# Altium schematic sheet Sensor_Glove_Sensors-X01.SchDoc: DB_Sensors-X02
size Letter; Organization: Georiga Tech; Address1: North Ave NW; Address3: Atlanta, GA; Address4: USA 30332; DocumentNumber: 1; Revision: X02; SheetNumber: 5; SheetTotal: 5
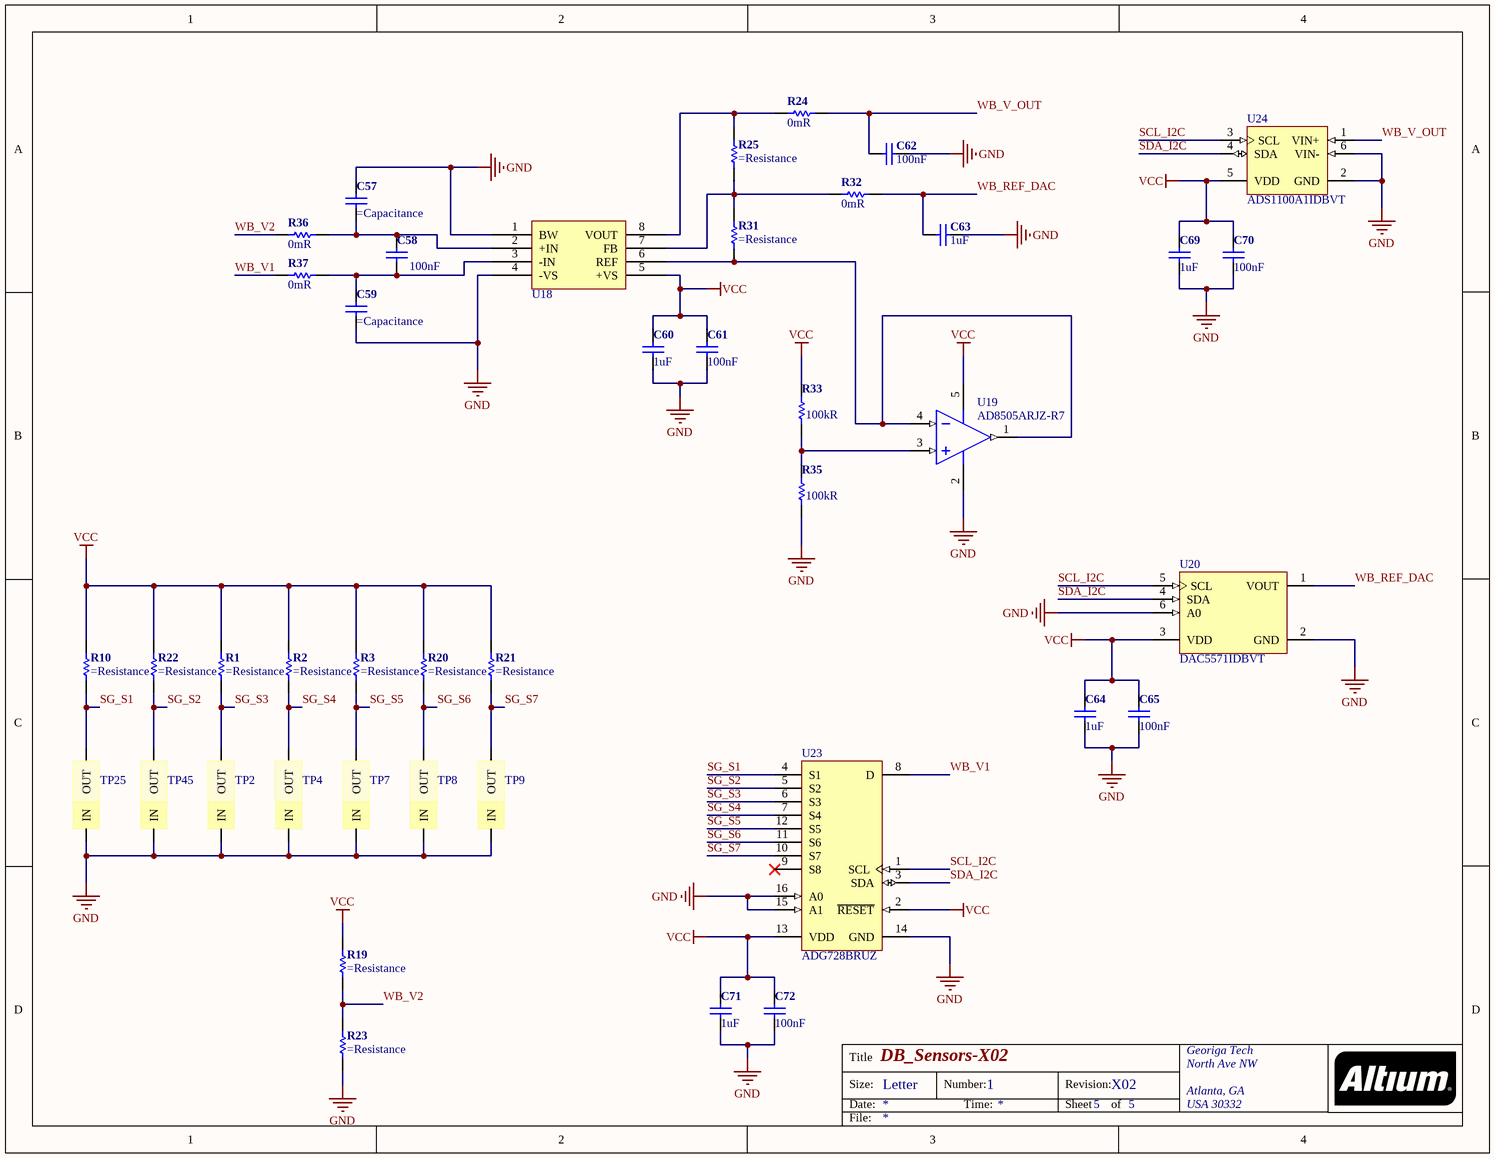
[diagram p0: Sensor_Glove_Sensors-X01.SchDoc]

## Parts
C57  (no value)  [C0402]
C58  100nF  [C0402]
C59  (no value)  [C0402]
C60  1uF  [C0402]
C61  100nF  [C0402]
C62  100nF  [C0402]
C63  1uF  [C0402]
C64  1uF  [C0402]
C65  100nF  [C0402]
C69  1uF  [C0402]
C70  100nF  [C0402]
C71  1uF  [C0402]
C72  100nF  [C0402]
R1  (no value)  [R0402]
R2  (no value)  [R0402]
R3  (no value)  [R0402]
R10  (no value)  [R0402]
R19  (no value)  [R0402]
R20  (no value)  [R0402]
R21  (no value)  [R0402]
R22  (no value)  [R0402]
R23  (no value)  [R0402]
R24  0mR  [R0402]
R25  (no value)  [R0402]
R31  (no value)  [R0402]
R32  0mR  [R0402]
R33  100kR  [R0402]
R35  100kR  [R0402]
R36  0mR  [R0402]
R37  0mR  [R0402]
TP2  JUMPER  [JUMPER]  (value not drawn)
TP4  JUMPER  [JUMPER]  (value not drawn)
TP7  JUMPER  [JUMPER]  (value not drawn)
TP8  JUMPER  [JUMPER]  (value not drawn)
TP9  JUMPER  [JUMPER]  (value not drawn)
TP25  JUMPER  [JUMPER]  (value not drawn)
TP45  JUMPER  [JUMPER]  (value not drawn)
U18  Instrumentation Amplifier  [8-MSOP]  (value not drawn)
U19  AD8505ARJZ-R7  [ADI-RJ-5_N]
U20  DAC5571IDBVT  [TI-DBV6_M]
U23  ADG728BRUZ  [ADI-RU-16_M]
U24  ADS1100A1IDBVT  [TI-DBV6_N]

## Nets
GND: C57.1 C59.2 C60.2 C61.2 C62.2 C63.2 C64.2 C65.2 C69.2 C70.2 C71.2 C72.2 R23.2 R35.2 TP2.1(IN) TP4.1(IN) TP7.1(IN) TP8.1(IN) TP9.1(IN) TP25.1(IN) TP45.1(IN) U18.1(BW) U18.4(-VS) U19.2(-V) U20.2(GND) U20.6(A0) U23.14(GND) U23.15(A1) U23.16(A0) U24.2(GND) U24.6(VIN-)
VCC: C60.1 C61.1 C64.1 C65.1 C69.1 C70.1 C71.1 C72.1 R1.1 R2.1 R3.1 R10.1 R19.1 R20.1 R21.1 R22.1 R33.1 U18.5(+VS) U19.5(+V) U20.3(VDD) U23.2(~{RESET}) U23.13(VDD) U24.5(VDD)
SCL_I2C: U20.5(SCL) U23.1(SCL) U24.3(SCL)
SDA_I2C: U20.4(SDA) U23.3(SDA) U24.4(SDA)
SG_S1: R10.2 TP25.2(OUT) U23.4(S1)
SG_S2: R22.2 TP45.2(OUT) U23.5(S2)
SG_S3: R1.2 TP2.2(OUT) U23.6(S3)
SG_S4: R2.2 TP4.2(OUT) U23.7(S4)
SG_S5: R3.2 TP7.2(OUT) U23.12(S5)
SG_S6: R20.2 TP8.2(OUT) U23.11(S6)
SG_S7: R21.2 TP9.2(OUT) U23.10(S7)
WB_REF_DAC: C63.1 R32.2 U20.1(VOUT)
WB_V1: R37.1 U23.8(D)
WB_V2: R19.2 R23.1 R36.1
WB_V_OUT: C62.1 R24.2 U24.1(VIN+)
NetC57_2: C57.2 C58.1 R36.2 U18.2(+IN)
NetC58_2: C58.2 C59.1 R37.2 U18.3(-IN)
NetR24_1: R24.1 R25.2 U18.8(VOUT)
NetR25_1: R25.1 R31.2 R32.1 U18.7(FB)
NetR31_1: R31.1 U18.6(REF) U19.1(OUT) U19.4(-IN)
NetR33_2: R33.2 R35.1 U19.3(+IN)

Not connected (* = marked no-connect by the designer): U23 9(S8)*

## Notes on the sheet
- Title
- Size:
- Date:
- Letter
- Number:
- Time:
- Revision:
- Sheet
- of
- File:

## Library data of the parts
C57 C59 = C-0402(1005): ___ OHM ___ mW 0402(1005) SMD; ComponentLink1URL: https://datasheet.ciiva.com/169/product-169683.pdf; ComponentLink1Description: https://datasheet.ciiva.com/169/product-169683.pdf
C58 C61 C62 C65 C70 C72 = C-0402(1005): Ceramic Capacitor, Multilayer, Ceramic, 25V, 10% +Tol, 10% -Tol, X5R, 15% TC, 0.1uF, Surface Mount, 0402; Manufacturer: Taiyo Yuden; Manufacturer Part Number: TMK105BJ104KV-F; ComponentLink1URL: https://datasheet.ciiva.com/169/product-169683.pdf; ComponentLink1Description: https://datasheet.ciiva.com/169/product-169683.pdf; Supplier 1: Digi-Key; Supplier Part Number 1: 587-1456-1-ND; RoHS: Yes; Category: Ceramic Capacitors; Stock 1: 21960903; Pricing 1: 1=0.10000, 10=0.04400, 50=0.02400, 100=0.01960, 500=0.01398, 1000=0.01098, 2500=0.00998, 5000=0.00918 (USD); Mount: Surface Mount; Case/Package: 0402; Number of Pins: 2; Weight: 2.3E-05oz; Case Code (Imperial): 0402; Case Code (Metric): 1005; Min Operating Temperature: -55°C; Max Operating Temperature: 85°C; Capacitance: 100nF; Tolerance: 10%; Packaging: Tape and Reel; Dielectric: X5R; Voltage Rating (DC): 25V; Voltage Rating: 25V; Package Quantity: 1; Termination: SMD/SMT; Resistor Type: Ceramic; Voltage: 25V; Length: 1mm; Height: 0.5mm; Width: 0.5mm; Depth: 0.5mm; Thickness: 0.022inch; REACH SVHC: No SVHC; Lead Free: Lead Free; Halogen Free: Halogen Free; ComponentLink2URL: https://datasheet.ciiva.com:443/pdfs/VipMasterIC/IC/TAIY/TAIY-S-A0009103435/TAIY-S-A0009103038-1.pdf?src-supplier=IHS+Markit; ComponentLink2Description: https://datasheet.ciiva.com:443/pdfs/VipMasterIC/IC/TAIY/TAIY-S-A0009103435/TAIY-S-A0009103038-1.pdf?src-supplier=IHS+Markit; ComponentLink3URL: https://datasheet.ciiva.com/30051/25tmk105bj104kv-f-30051094.pdf?src-supplier=Onlinecomponents.com; ComponentLink3Description: https://datasheet.ciiva.com/30051/25tmk105bj104kv-f-30051094.pdf?src-supplier=Onlinecomponents.com; ComponentLink4URL: https://datasheet.ciiva.com/15922/28tmk105bj104kv-f-15922315.pdf?src-supplier=Onlinecomponents.com; ComponentLink4Description: https://datasheet.ciiva.com/15922/28tmk105bj104kv-f-15922315.pdf?src-supplier=Onlinecomponents.com; ComponentLink5URL: https://datasheet.ciiva.com/131/tmk105bj104kv-f-ss-131420.pdf?src-supplier=Digi-Key; ComponentLink5Description: https://datasheet.ciiva.com/131/tmk105bj104kv-f-ss-131420.pdf?src-supplier=Digi-Key; ComponentLink6URL: https://datasheet.ciiva.com/22768/1693457-22768649.pdf?src-supplier=Farnell; ComponentLink6Description: https://datasheet.ciiva.com/22768/1693457-22768649.pdf?src-supplier=Farnell
C60 C63 C64 C69 C71 = C-0402(1005): Ceramic Capacitor, Multilayer, Ceramic, 6.3V, 20% +Tol, 20% -Tol, X5R, 15% TC, 1uF, Surface Mount, 0402; Manufacturer: Yageo; Manufacturer Part Number: CC0402MRX5R5BB105; Dissipation Factor: 10%; ComponentLink1URL: https://datasheet.ciiva.com/169/product-169683.pdf; ComponentLink1Description: https://datasheet.ciiva.com/169/product-169683.pdf; Supplier 1: Digi-Key; Supplier Part Number 1: 311-1441-1-ND; RoHS: Yes; Category: Ceramic Capacitors; Stock 1: 4097; Pricing 1: 1=0.12000, 10=0.08500, 50=0.04860, 100=0.04020, 500=0.02818, 1000=0.02333, 2500=0.02172, 5000=0.01987 (USD); Mount: Surface Mount; Case/Package: 0402; Number of Pins: 2; Case Code (Imperial): 0402; Case Code (Metric): 1005; Min Operating Temperature: -55°C; Max Operating Temperature: 85°C; Capacitance: 1uF; Tolerance: 20%; Voltage Rating: 6.3V; Voltage Rating (DC): 6.3V; Packaging: Tape and Reel; Package Quantity: 1; Dielectric: X5R; Termination: SMD/SMT; Resistor Type: Ceramic; Length: 1mm; Height: 0.5mm; Width: 0.5mm; Thickness: 0.022inch; Depth: 0.5mm; Lead Free: Lead Free; Halogen Free: Halogen Free; ComponentLink2URL: https://datasheet.ciiva.com:443/pdfs/VipMasterIC/IC/YAGO/YAGO-S-A0006851646/YAGO-S-A0006851646-1.pdf?src-supplier=IHS+Markit; ComponentLink2Description: https://datasheet.ciiva.com:443/pdfs/VipMasterIC/IC/YAGO/YAGO-S-A0006851646/YAGO-S-A0006851646-1.pdf?src-supplier=IHS+Markit; ComponentLink3URL: https://datasheet.ciiva.com/176/mlccorderingcode-176806.pdf?src-supplier=Digi-Key; ComponentLink3Description: https://datasheet.ciiva.com/176/mlccorderingcode-176806.pdf?src-supplier=Digi-Key; ComponentLink4URL: https://datasheet.ciiva.com/176/mlccorderingcode-176807.pdf?src-supplier=Digi-Key; ComponentLink4Description: https://datasheet.ciiva.com/176/mlccorderingcode-176807.pdf?src-supplier=Digi-Key; ComponentLink5URL: https://datasheet.ciiva.com/176/mlccorderingcode-176808.pdf?src-supplier=Digi-Key; ComponentLink5Description: https://datasheet.ciiva.com/176/mlccorderingcode-176808.pdf?src-supplier=Digi-Key
R1-R3 R10 R19-R23 R25 R31 = R-0402(1005): ___ OHM ___ mW 0402(1005) SMD
R24 R32 R36 R37 = R-0402(1005): Fixed Resistor, Metal Glaze/thick Film, 0.0625W, 0ohm, Surface Mount, 0402; Manufacturer: Yageo; Manufacturer Part Number: AC0402JR-070RL; Voltage Rating: 50V; Power Rating: 62.5mW; Tolerance: 5%; Temperature Coefficient: 200ppm/°C; Max Power Dissipation: 63mW; Supplier 1: Digi-Key; Supplier Part Number 1: 311-0.0LBCT-ND; RoHS: Yes; Category: Chip SMD Resistors; Stock 1: 1100119; Pricing 1: 1=0.10000, 10=0.01900, 25=0.01400, 50=0.01080, 100=0.00790, 250=0.00604, 500=0.00482, 1000=0.00355, 5000=0.00255 (USD); Case/Package: 0402; Case Code (Imperial): 0402; Case Code (Metric): 1005; Min Operating Temperature: -55°C; Max Operating Temperature: 155°C; Resistance: 0mR; Packaging: Tape and Reel; Package Quantity: 1; Resistor Type: Thick Film; Termination: SMD/SMT; Number of Terminations: 2; Features: Moisture Resistant,Automotive AEC-Q200,Anti-Sulfur; Length: 0.039inch; Height: 0.015inch; Width: 0.02inch; Lead Free: Lead Free; ComponentLink1URL: https://datasheet.ciiva.com:443/pdfs/VipMasterIC/IC/YAGO/YAGO-S-A0003597364/YAGO-S-A0003597364-1.pdf?src-supplier=IHS+Markit; ComponentLink1Description: https://datasheet.ciiva.com:443/pdfs/VipMasterIC/IC/YAGO/YAGO-S-A0003597364/YAGO-S-A0003597364-1.pdf?src-supplier=IHS+Markit; ComponentLink2URL: http://www.mouser.com/ds/2/447/yageodocoutput-1111992.pdf?src-supplier=Mouser; ComponentLink2Description: http://www.mouser.com/ds/2/447/yageodocoutput-1111992.pdf?src-supplier=Mouser; ComponentLink3URL: http://www.yageo.com/NewPortal/yageodocoutput?fileName=/pdf/R-Chip/PYu-AC_51_RoHS_L_6.pdf&src-supplier=Digi-Key; ComponentLink3Description: http://www.yageo.com/NewPortal/yageodocoutput?fileName=/pdf/R-Chip/PYu-AC_51_RoHS_L_6.pdf&src-supplier=Digi-Key; ComponentLink4URL: http://www.yageo.com/documents/recent/PYu-AC_51_RoHS_L_2_revised.pdf?src-supplier=Future+Electronics; ComponentLink4Description: http://www.yageo.com/documents/recent/PYu-AC_51_RoHS_L_2_revised.pdf?src-supplier=Future+Electronics
R33 R35 = R-0402(1005): Fixed Resistor, Metal Glaze/thick Film, 0.0625W, 100000ohm, 50V, 1% +/-Tol, 100ppm/Cel, Surface Mount, 0402; Manufacturer: Yageo; Manufacturer Part Number: AC0402FR-07100KL; Power Rating: 62.5mW; Max Power Dissipation: 63mW; Temperature Coefficient: 100ppm/°C; Supplier 1: Digi-Key; Supplier Part Number 1: YAG3434CT-ND; RoHS: Yes; Category: Chip SMD Resistors; Stock 1: 239006; Pricing 1: 1=0.10000, 10=0.02000, 100=0.00830, 1000=0.00374, 2500=0.00324, 5000=0.00268 (USD); Case/Package: 0402; Case Code (Imperial): 0402; Case Code (Metric): 1005; Min Operating Temperature: -55°C; Max Operating Temperature: 155°C; Resistance: 100kR; Tolerance: 1%; Packaging: Tape and Reel; Voltage Rating: 50V; Resistor Type: Thick Film; Number of Terminations: 2; Termination: SMD/SMT; Features: Moisture Resistant,Automotive AEC-Q200; Length: 1mm; Height: 0.015inch; Width: 0.02inch; Depth: 0.5mm; Military Standard: Not; Lead Free: Lead Free; ComponentLink1URL: https://datasheet.ciiva.com:443/pdfs/VipMasterIC/IC/YAGO/YAGO-S-A0003597364/YAGO-S-A0003597364-1.pdf?src-supplier=IHS+Markit; ComponentLink1Description: https://datasheet.ciiva.com:443/pdfs/VipMasterIC/IC/YAGO/YAGO-S-A0003597364/YAGO-S-A0003597364-1.pdf?src-supplier=IHS+Markit; ComponentLink2URL: http://components.arrow.com/part/dataview/0323_03348509?src-supplier=Arrow+Europe; ComponentLink2Description: http://components.arrow.com/part/dataview/0323_03348509?src-supplier=Arrow+Europe; ComponentLink3URL: http://www.yageo.com/NewPortal/yageodocoutput?fileName=/pdf/R-Chip/PYu-AC_51_RoHS_L_6.pdf&src-supplier=Digi-Key; ComponentLink3Description: http://www.yageo.com/NewPortal/yageodocoutput?fileName=/pdf/R-Chip/PYu-AC_51_RoHS_L_6.pdf&src-supplier=Digi-Key; ComponentLink4URL: http://www.yageo.com/documents/recent/PYu-AC_51_RoHS_L_2.pdf?src-supplier=Mouser; ComponentLink4Description: http://www.yageo.com/documents/recent/PYu-AC_51_RoHS_L_2.pdf?src-supplier=Mouser; ComponentLink5URL: http://www.yageo.com/documents/recent/PYu-AC_51_RoHS_L_2_revised.pdf?src-supplier=Future+Electronics; ComponentLink5Description: http://www.yageo.com/documents/recent/PYu-AC_51_RoHS_L_2_revised.pdf?src-supplier=Future+Electronics
TP2 TP4 TP7-TP9 TP25 TP45 = JUMPER: SHUNT LP W/HANDLE 2 POS 30AU; Manufacturer: TE Connectivity; Manufacturer Part Number: 8815452; Number of Contacts: 2; Contact Current Rating: 3A; Contact Resistance: 15mR; Gender: Female; Pitch: 2.54mm; Approvals: UL,CSA; Supplier 1: Digi-Key; Supplier Part Number 1: A26242-ND; RoHS: Yes; Category: Headers and Wire Housings; Stock 1: 2099; Pricing 1: 1=0.280000, 10=0.262000, 25=0.223600, 50=0.195600, 100=0.181700, 250=0.160760, 500=0.153760, 1000=0.125800, 2500=0.115320 (USD); Contact Plating: Gold; Housing Color: Black; Housing Material: Thermoplastic; Contact Material: Bronze; Color: Black; Min Operating Temperature: -65°C; Max Operating Temperature: 105°C; Number of Rows: 1; Package Quantity: 14000; Packaging: Bag; Orientation: Straight; Number of Positions: 2; Contact Gender: Female; Current Rating: 3A; Termination: Solder; Length: 5.08mm; Height: 10.9mm; Depth: 10.9mm; Width: 2.5mm; Radiation Hardening: No; Flammability Rating: UL94 V-0; REACH SVHC: No SVHC; ComponentLink1URL: https://datasheet.ciiva.com/1455/92946-1455888.pdf?src-supplier=Newark; ComponentLink1Description: https://datasheet.ciiva.com/1455/92946-1455888.pdf?src-supplier=Newark; ComponentLink2URL: https://datasheet.ciiva.com/19459/841467-19459897.pdf?src-supplier=Jameco; ComponentLink2Description: https://datasheet.ciiva.com/19459/841467-19459897.pdf?src-supplier=Jameco; ComponentLink3URL: https://datasheet.ciiva.com/15174/getdatasheetpartid-155768-15174939.pdf?src-supplier=Verical; ComponentLink3Description: https://datasheet.ciiva.com/15174/getdatasheetpartid-155768-15174939.pdf?src-supplier=Verical; ComponentLink4URL: https://datasheet.ciiva.com/11754/0900766b80da19e8-11754990.pdf?src-supplier=RSComponents; ComponentLink4Description: https://datasheet.ciiva.com/11754/0900766b80da19e8-11754990.pdf?src-supplier=RSComponents; ComponentLink5URL: https://datasheet.ciiva.com/30154/eng-cs-1307819-section-6-7and8-0808-30154293.pdf?src-supplier=Onlinecomponents.com; ComponentLink5Description: https://datasheet.ciiva.com/30154/eng-cs-1307819-section-6-7and8-0808-30154293.pdf?src-supplier=Onlinecomponents.com; ComponentLink6URL: https://datasheet.ciiva.com/767/eng-cd-881545-k3-767850.pdf?src-supplier=Digi-Key; ComponentLink6Description: https://datasheet.ciiva.com/767/eng-cd-881545-k3-767850.pdf?src-supplier=Digi-Key; ComponentLink7URL: https://datasheet.ciiva.com/3120/eng-cs-1307819-section-6-7and8-0808-3120202.pdf?src-supplier=Avnet; ComponentLink7Description: https://datasheet.ciiva.com/3120/eng-cs-1307819-section-6-7and8-0808-3120202.pdf?src-supplier=Avnet
U18 = AD8237: Instrumentation Amplifier, 1 Func, 75uV Offset-Max, 0.2MHz Band Width, CMOS, PDSO8; Manufacturer: Analog Devices; Manufacturer Part Number: AD8237ARMZ-R7; Common Mode Rejection Ratio: 106dB; Slew Rate: 0.15V/µs; Number of Channels: 1; Max Supply Voltage: 5.5V; Nominal Supply Current: 115uA; Input Bias Current: 250pA; Min Supply Voltage: 1.8V; Output Current per Channel: 4mA; Voltage Gain: 60dB; Bandwidth: 20kHz; -3db Bandwidth: 200kHz; Supplier 1: Digi-Key; Supplier Part Number 1: AD8237ARMZ-R7CT-ND; RoHS: Yes; Category: Amplifiers - Op Amps, Buffer, Instrumentation; Stock 1: 18084; Pricing 1: 1=2.68000, 10=2.40400, 25=2.27240, 100=1.86850, 250=1.67660, 500=1.61600 (USD); Mount: Surface Mount; Case/Package: MSOP; Number of Pins: 8; Contact Plating: Tin,Matte; Min Operating Temperature: -40°C; Max Operating Temperature: 125°C; Input Offset Voltage (Vos): 75uV; Packaging: Tape and Reel; Package Quantity: 1; Number of Circuits: 1; Operating Supply Current: 115uA; Number of Elements: 1; Lead Free: Contains Lead; ComponentLink1URL: https://datasheet.ciiva.com:443/pdfs/VipMasterIC/IC/ANDI/ANDIS13412/ANDIS13412-1.pdf?src-supplier=IHS+Markit; ComponentLink1Description: https://datasheet.ciiva.com:443/pdfs/VipMasterIC/IC/ANDI/ANDIS13412/ANDIS13412-1.pdf?src-supplier=IHS+Markit; ComponentLink2URL: https://datasheet.ciiva.com/6626/ad8237-6626733.pdf?src-supplier=Digi-Key; ComponentLink2Description: https://datasheet.ciiva.com/6626/ad8237-6626733.pdf?src-supplier=Digi-Key; ComponentLink3URL: https://datasheet.ciiva.com/8582/ad8237-8582303.pdf?src-supplier=Avnet; ComponentLink3Description: https://datasheet.ciiva.com/8582/ad8237-8582303.pdf?src-supplier=Avnet
U19 = CMP-0384-01459-1: Single Channel Rail-to-Rail Operational Amplifier, 95 Hz BW, 13 mV/us SR, Industrial, 5-pin SOT23 (RJ-5), Reel; Manufacturer: Analog Devices; Max Supply Voltage: 5V; Common Mode Rejection Ratio: 90dB; Gain Bandwidth Product: 95kHz; Min Supply Voltage: 1.8V; Voltage Gain: 120dB; Min Dual Supply Voltage: 900mV; Max Dual Supply Voltage: 2.5V; Slew Rate: 0.013V/µs; Number of Channels: 1; Input Bias Current: 1pA; Input Offset Voltage (Vos): 2.5mV; Power Supply Rejection Ratio (PSRR): 110dB; Operating Supply Current: 25.5uA; Output Current per Channel: 45mA; Operating Supply Voltage: 3V; Input Capacitance: 4.2pF; Supplier 1: Digi-Key; Supplier Part Number 1: AD8505ARJZ-R7CT-ND; Manufacturer Part Number: AD8505ARJZ-R7; RoHS: Yes; Category: Amplifiers - Op Amps, Buffer, Instrumentation; Stock 1: 2044; Pricing 1: 1=1.55000, 10=1.38700, 25=1.31600, 100=1.01050, 250=0.89300, 500=0.84600, 1000=0.68150 (USD); Case/Package: SOT-23-5; Number of Pins: 5; Contact Plating: Tin,Matte; Min Operating Temperature: -40°C; Max Operating Temperature: 125°C; Packaging: Tape and Reel; Number of Circuits: 1; Package Quantity: 3000; Number of Elements: 1; Unity Gain Bandwidth Product: 95kHz; Number of Amplifiers: 1; Quiescent Current: 25.5uA; Bandwidth: 95kHz; Lead Free: Contains Lead; REACH SVHC: No SVHC; ComponentLink1URL: https://datasheet.ciiva.com:443/pdfs/VipMasterIC/IC/ANDI/ANDI-S-A0003407821/ANDI-S-A0003407815-1.pdf?src-supplier=IHS+Markit; ComponentLink1Description: https://datasheet.ciiva.com:443/pdfs/VipMasterIC/IC/ANDI/ANDI-S-A0003407821/ANDI-S-A0003407815-1.pdf?src-supplier=IHS+Markit; ComponentLink2URL: https://datasheet.ciiva.com/22712/1610834-22712017.pdf?src-supplier=Element14; ComponentLink2Description: https://datasheet.ciiva.com/22712/1610834-22712017.pdf?src-supplier=Element14; ComponentLink3URL: https://datasheet.ciiva.com/11711/ad8505-8506-8508-11711719.pdf?src-supplier=Avnet; ComponentLink3Description: https://datasheet.ciiva.com/11711/ad8505-8506-8508-11711719.pdf?src-supplier=Avnet; ComponentLink4URL: https://datasheet.ciiva.com/1135/1610834-1135532.pdf?src-supplier=Element14; ComponentLink4Description: https://datasheet.ciiva.com/1135/1610834-1135532.pdf?src-supplier=Element14
U20 = CMP-0004-00333-1: Low-Power, 8-Bit DAC with High-Speed I2C Input, -40 to 105 degC, 6-pin SOT23 (DBV6), Green (RoHS & no Sb/Br); Manufacturer: Texas Instruments; Settling Time: 8us; Number of Bits: 8; Operating Supply Voltage: 5V; Resolution: 8b; Sampling Rate: 188KS/s; Output Type: Voltage; Number of Channels: 1; Max Supply Voltage: 5.5V; Min Supply Voltage: 2.7V; Supply Type: Single; Polarity: Unipolar; Integral Nonlinearity (INL): 1LSB; Nominal Supply Current: 155uA; Differential Nonlinearity: 0.25LSB; Power Consumption: 400uW; Supplier 1: Digi-Key; Supplier Part Number 1: 296-17199-1-ND; Manufacturer Part Number: DAC5571IDBVT; RoHS: Yes; Category: Digital to Analog Converters (DACs); Stock 1: 4888; Pricing 1: 1=1.49000, 10=1.34100, 25=1.26520, 100=1.01200 (USD); Case/Package: SOT-23; Number of Pins: 6; Weight: 0.00127oz; Contact Plating: Gold; Min Operating Temperature: -40°C; Max Operating Temperature: 105°C; Packaging: Tape and Reel; Package Quantity: 250; Interface: I2C; Conversion Rate: 188KS/s; Number of DAC Channels: 1; Number of Converters: 1; Operating Supply Current: 155uA; Length: 2.9mm; Height: 1.15mm; Width: 1.6mm; Radiation Hardening: No; Lead Free: Lead Free; REACH SVHC: No SVHC; ComponentLink1URL: https://www.ti.com:443/lit/ds/symlink/dac5571.pdf?src-supplier=IHS+Markit; ComponentLink1Description: https://www.ti.com:443/lit/ds/symlink/dac5571.pdf?src-supplier=IHS+Markit; ComponentLink2URL: https://datasheet.ciiva.com/15146/getdatasheetpartid-184785-15146834.pdf?src-supplier=Verical; ComponentLink2Description: https://datasheet.ciiva.com/15146/getdatasheetpartid-184785-15146834.pdf?src-supplier=Verical; ComponentLink3URL: https://datasheet.ciiva.com/1597/dac5571-1597245.pdf?src-supplier=Newark; ComponentLink3Description: https://datasheet.ciiva.com/1597/dac5571-1597245.pdf?src-supplier=Newark; ComponentLink4URL: https://datasheet.ciiva.com/34302/1337393-34302226.pdf?src-supplier=Jameco; ComponentLink4Description: https://datasheet.ciiva.com/34302/1337393-34302226.pdf?src-supplier=Jameco; ComponentLink5URL: https://datasheet.ciiva.com/4779/slas405a-117423-4779268.pdf?src-supplier=Mouser; ComponentLink5Description: https://datasheet.ciiva.com/4779/slas405a-117423-4779268.pdf?src-supplier=Mouser; ComponentLink6URL: https://datasheet.ciiva.com/41460/001186519-da-01-en-8-bit-12c-single-dac5571idbvt-sot-23-tid-41460679.pdf?src-supplier=Conrad; ComponentLink6Description: https://datasheet.ciiva.com/41460/001186519-da-01-en-8-bit-12c-single-dac5571idbvt-sot-23-tid-41460679.pdf?src-supplier=Conrad; ComponentLink7URL: https://datasheet.ciiva.com/26235/dac5571-26235157.pdf?src-supplier=Avnet+Europe; ComponentLink7Description: https://datasheet.ciiva.com/26235/dac5571-26235157.pdf?src-supplier=Avnet+Europe; ComponentLink8URL: https://datasheet.ciiva.com/1362/dac5571-1362876.pdf?src-supplier=Digi-Key; ComponentLink8Description: https://datasheet.ciiva.com/1362/dac5571-1362876.pdf?src-supplier=Digi-Key; ComponentLink9URL: https://datasheet.ciiva.com/1362/dac5571-1362877.pdf?src-supplier=Digi-Key; ComponentLink9Description: https://datasheet.ciiva.com/1362/dac5571-1362877.pdf?src-supplier=Digi-Key; ComponentLink10URL: https://datasheet.ciiva.com/1362/dac5571-1362878.pdf?src-supplier=Digi-Key; ComponentLink10Description: https://datasheet.ciiva.com/1362/dac5571-1362878.pdf?src-supplier=Digi-Key; ComponentLink11URL: https://datasheet.ciiva.com/3040/dac5571-3040451.pdf?src-supplier=Avnet; ComponentLink11Description: https://datasheet.ciiva.com/3040/dac5571-3040451.pdf?src-supplier=Avnet; ComponentLink12URL: https://datasheet.ciiva.com/3040/dac5571-3040452.pdf?src-supplier=Avnet; ComponentLink12Description: https://datasheet.ciiva.com/3040/dac5571-3040452.pdf?src-supplier=Avnet; ComponentLink13URL: https://datasheet.ciiva.com/46430/1762718-46430597.pdf?src-supplier=Element14; ComponentLink13Description: https://datasheet.ciiva.com/46430/1762718-46430597.pdf?src-supplier=Element14
U23 = CMP-0798-00197-1: CMOS, Low Voltage, 2-Wire Serially Controlled, Matrix Switch, -40 to 85 degC, 16-pin SOP (RU-16), Tube; Manufacturer: Analog Devices; Min Supply Voltage: 2.7V; Max Supply Voltage: 5.5V; On-State Resistance: 4.5R; Throw Configuration: DPST; Number of Circuits: 1; -3db Bandwidth: 65MHz; Max Power Dissipation: 100uW; Number of Inputs: 8; Max Supply Current: 20uA; Interface: Serial,2-Wire; Operating Supply Current: 10uA; Turn-Off Delay Time: 85ns; Turn-On Delay Time: 95ns; High Level Output Current: 120mA; Drain to Source Resistance: 2.5R; Supplier 1: Digi-Key; Supplier Part Number 1: ADG728BRUZ-ND; Manufacturer Part Number: ADG728BRUZ; RoHS: Yes; Category: Decoders and Multiplexers; Stock 1: 1351; Pricing 1: 1=5.54000, 10=4.97400, 25=4.70240, 100=3.86650, 250=3.46940, 500=3.34400, 1000=3.03050 (USD); Case/Package: TSSOP; Number of Pins: 16; Contact Plating: Tin,Matte; Min Operating Temperature: -40°C; Max Operating Temperature: 85°C; Packaging: Rail/Tube; Package Quantity: 96; Number of Channels: 1; Number of Outputs: 1; Bandwidth: 65MHz; Number of Bits: 8; Nominal Supply Current: 20uA; Length: 5mm; Height: 1.05mm; Width: 4.4mm; Radiation Hardening: No; Lead Free: Contains Lead; REACH SVHC: No SVHC; ComponentLink1URL: https://datasheet.ciiva.com:443/pdfs/VipMasterIC/IC/ANDI/ANDIS13257/ANDIS13257-1.pdf?src-supplier=IHS+Markit; ComponentLink1Description: https://datasheet.ciiva.com:443/pdfs/VipMasterIC/IC/ANDI/ANDIS13257/ANDIS13257-1.pdf?src-supplier=IHS+Markit; ComponentLink2URL: https://datasheet.ciiva.com/1171/1610644-1171108.pdf?src-supplier=Element14; ComponentLink2Description: https://datasheet.ciiva.com/1171/1610644-1171108.pdf?src-supplier=Element14; ComponentLink3URL: https://datasheet.ciiva.com/5797/adg728-729-5797207.pdf?src-supplier=Farnell; ComponentLink3Description: https://datasheet.ciiva.com/5797/adg728-729-5797207.pdf?src-supplier=Farnell; ComponentLink4URL: https://datasheet.ciiva.com/1668/adg728-729-1668904.pdf?src-supplier=Digi-Key; ComponentLink4Description: https://datasheet.ciiva.com/1668/adg728-729-1668904.pdf?src-supplier=Digi-Key; ComponentLink5URL: https://datasheet.ciiva.com/2978/adg728-729-2978667.pdf?src-supplier=Avnet; ComponentLink5Description: https://datasheet.ciiva.com/2978/adg728-729-2978667.pdf?src-supplier=Avnet; ComponentLink6URL: https://datasheet.ciiva.com/7986/adg728-729-7986413.pdf?src-supplier=Element14; ComponentLink6Description: https://datasheet.ciiva.com/7986/adg728-729-7986413.pdf?src-supplier=Element14; ComponentLink7URL: https://datasheet.ciiva.com/48708/001248036-da-01-en-ic-mux-demux-8x1-adg728bruz-tssop-16-adi-48708636.pdf?src-supplier=Conrad; ComponentLink7Description: https://datasheet.ciiva.com/48708/001248036-da-01-en-ic-mux-demux-8x1-adg728bruz-tssop-16-adi-48708636.pdf?src-supplier=Conrad
U24 = CMP-0003-00255-2: Self-Calibrating, 16-Bit ADC, -40 to 85 degC, 6-pin SOT23 (DBV6), Green (RoHS & no Sb/Br); Manufacturer: Texas Instruments; Number of Channels: 1; Max Power Dissipation: 750uW; Interface: I2C; Number of Bits: 16; Sampling Rate: 128S/s; Resolution: 16b; Polarity: Bipolar; Max Supply Voltage (DC): 5.5V; Min Supply Voltage (DC): 2.7V; Supply Type: Single; Nominal Supply Current: 90uA; Operating Supply Voltage: 5V; Differential Nonlinearity: 1LSB; Supplier 1: Digi-Key; Supplier Part Number 1: 296-14298-1-ND; Manufacturer Part Number: ADS1100A1IDBVT; RoHS: Yes; Category: Analog to Digital Converters (ADCs); Stock 1: 376; Pricing 1: 1=5.33000, 10=4.79100, 25=4.52920, 100=3.72410 (USD); Case/Package: SOT-23; Number of Pins: 6; Contact Plating: Gold; Min Operating Temperature: -40°C; Max Operating Temperature: 85°C; Packaging: Tape and Reel; Package Quantity: 250; Number of Inputs: 1; Number of A/D Converters: 1; Number of Converters: 1; Number of Analog Inputs: 1; Conversion Rate: 128S/s; Min Supply Voltage: 2.7V; Max Supply Voltage: 5.5V; Power Dissipation: 750uW; Number of Elements: 1; Length: 2.9mm; Height: 1.15mm; Width: 1.6mm; Radiation Hardening: No; Lead Free: Lead Free; REACH SVHC: No SVHC; ComponentLink1URL: https://www.ti.com:443/lit/ds/symlink/ads1100.pdf?src-supplier=IHS+Markit; ComponentLink1Description: https://www.ti.com:443/lit/ds/symlink/ads1100.pdf?src-supplier=IHS+Markit; ComponentLink2URL: https://datasheet.ciiva.com/7226/70865-7226785.pdf?src-supplier=Newark; ComponentLink2Description: https://datasheet.ciiva.com/7226/70865-7226785.pdf?src-supplier=Newark; ComponentLink3URL: https://datasheet.ciiva.com/26943/getdatasheetpartid-228526-26943613.pdf?src-supplier=Verical; ComponentLink3Description: https://datasheet.ciiva.com/26943/getdatasheetpartid-228526-26943613.pdf?src-supplier=Verical; ComponentLink4URL: https://datasheet.ciiva.com/26797/ads1100a1idbvt-26797549.pdf?src-supplier=IIIC; ComponentLink4Description: https://datasheet.ciiva.com/26797/ads1100a1idbvt-26797549.pdf?src-supplier=IIIC; ComponentLink5URL: https://datasheet.ciiva.com/1261/ads1100-1261111.pdf?src-supplier=Digi-Key; ComponentLink5Description: https://datasheet.ciiva.com/1261/ads1100-1261111.pdf?src-supplier=Digi-Key; ComponentLink6URL: https://datasheet.ciiva.com/3038/sbas239b-3038715.pdf?src-supplier=Avnet; ComponentLink6Description: https://datasheet.ciiva.com/3038/sbas239b-3038715.pdf?src-supplier=Avnet; ComponentLink7URL: https://datasheet.ciiva.com/1261/ads1100-1261110.pdf?src-supplier=Digi-Key; ComponentLink7Description: https://datasheet.ciiva.com/1261/ads1100-1261110.pdf?src-supplier=Digi-Key; ComponentLink8URL: https://datasheet.ciiva.com/26236/sbas239b-26236358.pdf?src-supplier=Avnet+Europe; ComponentLink8Description: https://datasheet.ciiva.com/26236/sbas239b-26236358.pdf?src-supplier=Avnet+Europe; ComponentLink9URL: https://datasheet.ciiva.com/1261/ads1100-1261112.pdf?src-supplier=Digi-Key; ComponentLink9Description: https://datasheet.ciiva.com/1261/ads1100-1261112.pdf?src-supplier=Digi-Key; ComponentLink10URL: https://datasheet.ciiva.com/22696/1882275-22696410.pdf?src-supplier=Element14; ComponentLink10Description: https://datasheet.ciiva.com/22696/1882275-22696410.pdf?src-supplier=Element14; ComponentLink11URL: https://datasheet.ciiva.com/3038/sbas239b-3038716.pdf?src-supplier=Avnet; ComponentLink11Description: https://datasheet.ciiva.com/3038/sbas239b-3038716.pdf?src-supplier=Avnet